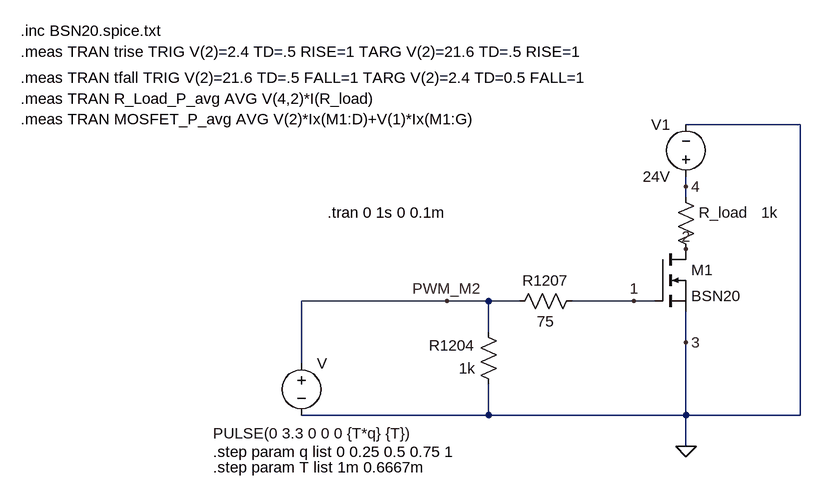
[diagram p0: schematic sim1.asc]
sim1.asc, the LTspice schematic file:
Version 4
SHEET 1 1444 680
WIRE 384 -112 208 -112
WIRE 208 -16 208 -32
WIRE 208 0 208 -16
WIRE -160 160 -384 160
WIRE -96 160 -160 160
WIRE -48 160 -96 160
WIRE 128 160 32 160
WIRE 160 160 128 160
WIRE -96 208 -96 160
WIRE 208 224 208 176
WIRE -384 256 -384 160
WIRE -96 336 -96 288
WIRE -96 336 -384 336
WIRE 208 336 208 224
WIRE 208 336 -96 336
WIRE 384 336 384 -112
WIRE 384 336 208 336
WIRE 208 384 208 336
FLAG 208 384 0
FLAG -160 160 PWM_M2
FLAG 128 160 1
FLAG 208 80 2
FLAG 208 224 3
FLAG 208 -16 4
SYMBOL res 48 144 R90
WINDOW 0 0 56 VBottom 2
WINDOW 3 32 56 VTop 2
SYMATTR InstName R1207
SYMATTR Value 75
SYMBOL res -80 304 R180
WINDOW 0 36 76 Left 2
WINDOW 3 36 40 Left 2
SYMATTR InstName R1204
SYMATTR Value 1k
SYMBOL voltage 208 -16 R180
WINDOW 0 24 96 Left 2
WINDOW 3 24 16 Left 2
WINDOW 123 0 0 Left 0
WINDOW 39 0 0 Left 0
SYMATTR InstName V1
SYMATTR Value 24V
SYMBOL voltage -384 240 R0
WINDOW 3 -136 124 Left 2
WINDOW 123 0 0 Left 0
WINDOW 39 0 0 Left 0
SYMATTR Value PULSE(0 3.3 0 0 0 {T*q} {T})
SYMATTR InstName V
SYMBOL res 192 -16 R0
WINDOW 3 132 40 Left 2
SYMATTR Value 1k
SYMATTR InstName R_load
SYMBOL nmos 160 80 R0
SYMATTR InstName M1
SYMATTR Value BSN20
SYMATTR Prefix X
TEXT -344 24 Left 2 !.tran 0 1s 0 0.1m
TEXT -816 -256 Left 2 !.inc BSN20.spice.txt
TEXT -816 -152 Left 2 !.meas TRAN R_Load_P_avg AVG V(4,2)*I(R_load)
TEXT -816 -120 Left 2 !.meas TRAN MOSFET_P_avg AVG V(2)*Ix(M1:D)+V(1)*Ix(M1:G)
TEXT -816 -224 Left 2 !.meas TRAN trise TRIG V(2)=2.4 TD=.5 RISE=1 TARG V(2)=21.6 TD=.5 RISE=1
TEXT -816 -184 Left 2 !.meas TRAN tfall TRIG V(2)=21.6 TD=.5 FALL=1 TARG V(2)=2.4 TD=0.5 FALL=1
TEXT -520 392 Left 2 !.step param q list 0 0.25 0.5 0.75 1
TEXT -520 416 Left 2 !.step param T list 1m 0.6667m

The netlist it stands for:
* sim1.asc
R1207 1 PWM_M2 75
R1204 0 PWM_M2 1k
V1 4 0 24V
V PWM_M2 0 PULSE(0 3.3 0 0 0 {T*q} {T})
R_load 4 2 1k
XM1 2 1 0 BSN20  ; pins D G S
.tran 0 1s 0 0.1m
.inc BSN20.spice.txt
.meas TRAN R_Load_P_avg AVG V(4,2)*I(R_load)
.meas TRAN MOSFET_P_avg AVG V(2)*Ix(M1:D)+V(1)*Ix(M1:G)
.meas TRAN trise TRIG V(2)=2.4 TD=.5 RISE=1 TARG V(2)=21.6 TD=.5 RISE=1
.meas TRAN tfall TRIG V(2)=21.6 TD=.5 FALL=1 TARG V(2)=2.4 TD=0.5 FALL=1
.step param q list 0 0.25 0.5 0.75 1
.step param T list 1m 0.6667m
.backanno
.end